# Altium schematic sheet Sense.SchDoc
size OrCAD A
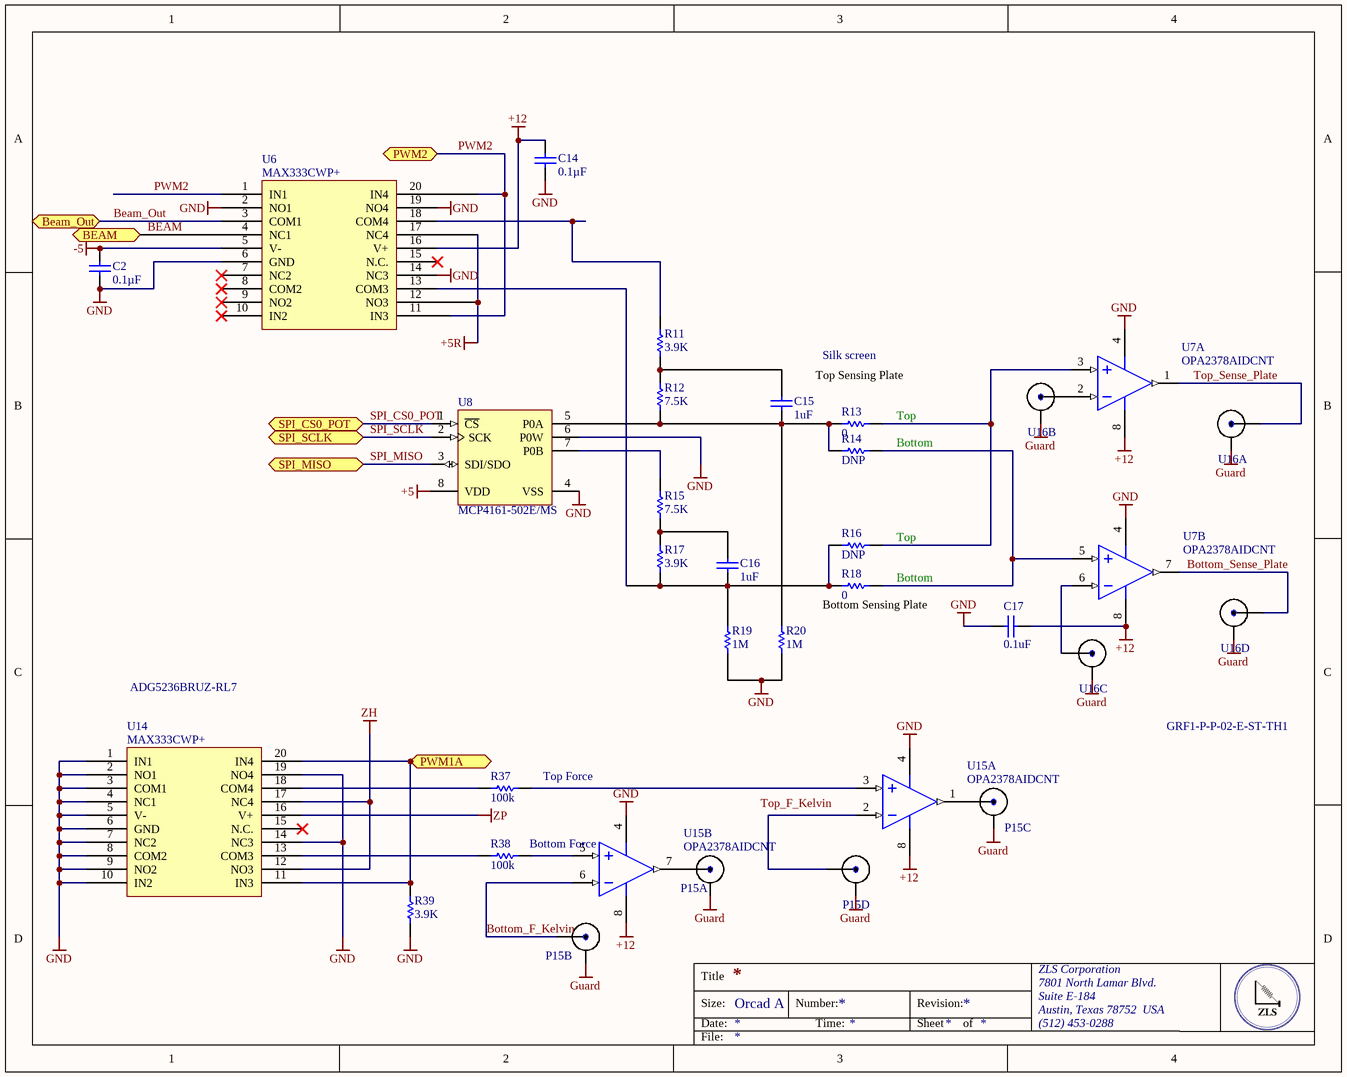
[diagram p0: Sense.SchDoc]

## Parts
C2  Capacitance: 0.1µF  [CAPC0805(2012)145_N]  (hidden comment: CAP CER 0.1UF 25V X7R 0805)
C14  Capacitance: 0.1µF  [CAPC0805(2012)145_N]  (hidden comment: CAP CER 0.1UF 25V X7R 0805)
C15  1uF  [CAPC0603(1608)100_L]
C16  1uF  [CAPC0603(1608)100_L]
C17  0.1uF  [CAPC0402(1005)60_L]
P15  GRF1-P-P-04-E-ST-TH1  [GRF1-P-P-04-E-ST-TH1]  (value not drawn)  (parts A,B,C,D of 4)
R11  3.9K  [RESC0402(1005)_M]
R12  7.5K  [RESC0402(1005)_M]
R13  0  [RESC0402(1005)_M]
R14  DNP  [RESC0402(1005)_M]
R15  7.5K  [RESC0402(1005)_M]
R16  DNP  [RESC0402(1005)_M]
R17  3.9K  [RESC0402(1005)_M]
R18  0  [RESC0402(1005)_M]
R19  1M  [RESC0402(1005)_M]
R20  1M  [RESC0402(1005)_M]
R37  100k  [RESC0402(1005)_M]
R38  100k  [RESC0402(1005)_M]
R39  3.9K  [RESC0402(1005)_M]
U6  MAX333CWP+  [TSOP65P640X90-20N]
U7  OPA2378AIDCNT  [DCN0008A_M]  (parts A,B of 2)
U8  MCP4161-502E/MS  [MSOP-MS8_N]
U14  MAX333CWP+  [TSOP65P640X90-20N]
U15  OPA2378AIDCNT  [DCN0008A_M]  (parts A,B of 2)
U16  GRF1-P-P-04-E-ST-TH1  [GRF1-P-P-04-E-ST-TH1]  (value not drawn)  (parts A,B,C,D of 4)

## Ports
BEAM, Beam_Out, PWM1A, PWM2, SPI_CS0_POT, SPI_MISO, SPI_SCLK

## Nets
+5: U8.8(VDD)
+5R: U6.12(NO3) U6.17(NC4)
+12: C14.2 C17.2 U6.16(V+) U7.8(V+) U15.8(V+)
-5: C2.1 U6.5(V-)
GND: C2.2 C14.1 C17.1 R19.1 R20.1 R39.1 U6.2(NO1) U6.6(GND) U6.14(NC3) U6.19(NO4) U7.4(V-) U8.4(VSS) U8.6(P0W) U14.1(IN1) U14.2(NO1) U14.3(COM1) U14.4(NC1) U14.5(V-) U14.6(GND) U14.7(NC2) U14.8(COM2) U14.9(NO2) U14.10(IN2) U14.14(NC3) U14.19(NO4) U15.4(V-)
Guard: P15.5 P15.6 P15.7 P15.8 U16.5 U16.6 U16.7 U16.8
ZH: U14.12(NO3) U14.17(NC4)
ZP: U14.16(V+)
BEAM: U6.4(NC1) ; port BEAM
Beam_Out: U6.3(COM1) ; port Beam_Out
Bottom_F_Kelvin: P15.2 U15.6(IN_B-)
Bottom_Sense_Plate: U7.7(OUT_B) U16.4
PWM1A: R39.2 U14.11(IN3) U14.20(IN4) ; port PWM1A
PWM2: U6.1(IN1) U6.11(IN3) U6.20(IN4) ; port PWM2
SPI_CS0_POT: U8.1(~{CS}) ; port SPI_CS0_POT
SPI_MISO: U8.3(SDI/SDO) ; port SPI_MISO
SPI_SCLK: U8.2(SCK) ; port SPI_SCLK
Top_Sense_Plate: U7.1(OUT_A) U16.1
NetC15_1: C15.1 R12.1 R13.2 R14.2 R20.2 U8.5(P0A)
NetC15_2: C15.2 R11.1 R12.2
NetC16_1: C16.1 R16.2 R17.1 R18.2 R19.2 U6.13(COM3)
NetC16_2: C16.2 R15.1 R17.2
NetP15_1: P15.1 U15.7(OUT_B)
NetP15_3: P15.3 U15.1(OUT_A)
NetP15_4: P15.4 U15.2(IN_A-)
NetR11_2: R11.2 U6.18(COM4)
NetR13_1: R13.1 R16.1 U7.3(IN_A+)
NetR14_1: R14.1 R18.1 U7.5(IN_B+)
NetR15_2: R15.2 U8.7(P0B)
NetR37_1: R37.1 U15.3(IN_A+)
NetR37_2: R37.2 U14.18(COM4)
NetR38_1: R38.1 U15.5(IN_B+)
NetR38_2: R38.2 U14.13(COM3)
NetU7_2: U7.2(IN_A-) U16.2
NetU7_6: U7.6(IN_B-) U16.3

Not connected (* = marked no-connect by the designer): U6 7(NC2)* 8(COM2)* 9(NO2)* 10(IN2)* 15(N.C.)*; U14 15(N.C.)*

## Notes on the sheet
- Top Sensing Plate
- Silk screen
- Top
- Bottom
- (near R16) Top
- (near R18) Bottom Sensing Plate
- ADG5236BRUZ-RL7
- GRF1-P-P-02-E-ST-TH1
- (near R37) Top Force
- (near U15) Bottom Force
- Labels drawn without touching a wire or pin: Top_F_Kelvin
- Title
- Size:
- Date:
- Orcad A
- Number:
- Time:
- Revision:
- Sheet
- of
- ZLS Corporation
- 7801 North Lamar Blvd.
- Suite E-184
- Austin, Texas 78752  USA
- (512) 453-0288
- File:

## Library data of the parts
C2 C14 = CMP-1036-04795-1: Manufacturer: Murata Electronics North America; Manufacturer Part Number: GRM21BR71E104KA01L; Tolerance: ±10%; Supplier 1: Digi-Key; Supplier Part Number 1: 490-1673-6-ND; RoHS: RoHS Compliant; Category: Capacitors; Stock 1: 891652; Pricing 1: 1=0.2, 10=0.145, 100=0.0683, 500=0.04788, 1000=0.03964 (USD); Packaging: Digi-Reel®; Part Status: Active; Voltage - Rated: 25V; Temperature Coefficient: X7R; Operating Temperature: -55°C ~ 125°C; Features: -; Ratings: -; Applications: General Purpose; Mounting Type: Surface Mount, MLCC; Package / Case: 0805 (2012 Metric); Size / Dimension: 0.079" L x 0.049" W (2.00mm x 1.25mm); Height - Seated (Max): -; Thickness (Max): 0.053" (1.35mm); Lead Spacing: -; Lead Style: -; ComponentLink1URL: http://www.murata.com/~/media/webrenewal/support/library/catalog/products/capacitor/mlcc/c02e.ashx; ComponentLink1Description: http://www.murata.com/~/media/webrenewal/support/library/catalog/products/capacitor/mlcc/c02e.ashx
C15 C16 = CMP-1035-00303-1: CAP 4.3pF 25V ±0.5pF 0603 (1608 Metric) Thickness 1mm SMD; Manufacturer: Samsung Electro-Mechanics; Manufacturer Part Number: CL10B105KA8NNNC; Tolerance: ±10%; Temperature Coefficient: X7R; Notification: Current market demand for these product types have resulted in fluctuating and extending lead times. Lead times may differ.; Supplier 1: Digi-Key; Supplier Part Number 1: 1276-1184-1-ND; RoHS: RoHS Compliant; Category: Capacitors; Stock 1: 1067488; Pricing 1: 1=0.1, 10=0.061, 100=0.027, 500=0.01926, 1000=0.01513 (USD); Packaging: Cut Tape (CT); Part Status: Active; Voltage - Rated: 25V; Operating Temperature: -55°C ~ 125°C; Features: -; Ratings: -; Applications: General Purpose; Mounting Type: Surface Mount, MLCC; Package / Case: 0603 (1608 Metric); Size / Dimension: 0.063" L x 0.032" W (1.60mm x 0.80mm); Height - Seated (Max): -; Thickness (Max): 0.035" (0.90mm); Lead Spacing: -; Lead Style: -; ComponentLink1URL: http://media.digikey.com/pdf/Data%20Sheets/Samsung%20PDFs/CL_Series_MLCC_ds.pdf; ComponentLink1Description: http://media.digikey.com/pdf/Data%20Sheets/Samsung%20PDFs/CL_Series_MLCC_ds.pdf
C17 = CMP-1034-00252-1: CAP CER 0.1UF 10V X7R 0402; Manufacturer: Murata Electronics North America; Manufacturer Part Number: GRM155R71A104KA01D; Tolerance: ±10%; Supplier 1: Digi-Key; Supplier Part Number 1: 490-6321-1-ND; RoHS: RoHS Compliant; Category: Capacitors; Stock 1: 2920395; Pricing 1: 1=0.1, 10=0.014, 100=0.0063, 500=0.00446, 1000=0.00351, 2500=0.00319, 5000=0.00293 (USD); Packaging: Cut Tape (CT); Part Status: Active; Voltage - Rated: 10V; Temperature Coefficient: X7R; Operating Temperature: -55°C ~ 125°C; Features: -; Ratings: -; Applications: General Purpose; Mounting Type: Surface Mount, MLCC; Package / Case: 0402 (1005 Metric); Size / Dimension: 0.039" L x 0.020" W (1.00mm x 0.50mm); Height - Seated (Max): -; Thickness (Max): 0.022" (0.55mm); Lead Spacing: -; ComponentLink1URL: http://www.murata.com/~/media/webrenewal/support/library/catalog/products/capacitor/mlcc/c02e.ashx?la=en-us; ComponentLink1Description: http://www.murata.com/~/media/webrenewal/support/library/catalog/products/capacitor/mlcc/c02e.ashx?la=en-us
R11 R12 R15 R17 R19 R20 R39 = CMP-1011-00463-1
R13 R14 R16 R18 R37 R38 = CMP-1011-00651-1
U6 U14 = MAX333CWP+: IC SWITCH QUAD SPDT 20TSSOP; Manufacturer: Maxim; Manufacturer Part Number: MAX333AEUP+; Max Supply Voltage: 30V; Min Supply Voltage: 10V; Min Dual Supply Voltage: 4.5V; Max Dual Supply Voltage: 20V; On-State Resistance: 35R; Operating Supply Current: 1uA; Supply Type: Single,Dual; Max Power Dissipation: 559mW; Turn-On Delay Time: 175ns; Turn-Off Delay Time: 145ns; Max Supply Current: 250uA; Number of Bits: 4; Dual Supply Voltage: 15V; Supplier 1: Mouser; Supplier Part Number 1: 700-MAX333AEUP; Stock 1: 664; Pricing 1: 1=6.77, 10=6.43, 50=5.8, 100=5.8, 1000=5.62, 10000=5.62 (USD); Case/Package: TSSOP; Number of Pins: 20; Weight: 0.006737oz; Min Operating Temperature: -40°C; Max Operating Temperature: 85°C; Packaging: Rail/Tube; Package Quantity: 74; Throw Configuration: SPDT; Number of Channels: 4; Length: 6.6mm; Height: 0.95mm; Width: 4.5mm; Radiation Hardening: No; Lead Free: Lead Free; REACH SVHC: Unknown; ComponentLink1URL: https://datasheet.ciiva.com/2978/max333a-2978850.pdf; ComponentLink1Description: https://datasheet.ciiva.com/2978/max333a-2978850.pdf; ComponentLink2URL: https://datasheet.ciiva.com/30478/0900766b81253c85-30478260.pdf; ComponentLink2Description: https://datasheet.ciiva.com/30478/0900766b81253c85-30478260.pdf; ComponentLink3URL: https://datasheet.ciiva.com/1674/max333a-1674617.pdf; ComponentLink3Description: https://datasheet.ciiva.com/1674/max333a-1674617.pdf; ComponentLink4URL: https://datasheet.ciiva.com/26825/max333aeup-26825546.pdf; ComponentLink4Description: https://datasheet.ciiva.com/26825/max333aeup-26825546.pdf
U7 U15 = CMP-0272-01124-3: Low-Noise, 900 kHz, RRIO, Precision Operational Amplifier, Zero-Drift Series, 2.2 to 5.5 V, -40 to 125 degC, 8-pin SOP (DCN8), Green (RoHS & no Sb/Br); Manufacturer: Texas Instruments; Number of Channels: 2; Offset Drift(Typ)(uV/C): 0.25; Total Supply Voltage(Min)(+5V is 5, +/-5V is 10): 2.2; Vn at 1kHz(Typ)(nV/rtHz): 20; Iq per channel(Max)(mA): 0.15; Total Supply Voltage(Max)(+5V is 5, +/-5V is 10): 5.5; Sub Family: Low Offset Voltage Amplifier (<=500uV), Low Power Amp (<=500uA), Low Supply Voltage Amplifier (<=2.7V), Precision Amplifier, Zero Drift Precision Amplifier; IIB(Max)(pA): 550; Vio (25C)(Max)(mV): 0.07; CMRR(Min)(dB): 100; Slew Rate(Typ)(V/us): 0.4; PartNumber: OPA2378AIDCNT; DatasheetVersion: SBOS417D; ComponentLink2Description: Datasheet; ComponentLink3URL: http://www.ti.com/lit/ml/mpds099c/mpds099c.pdf; ComponentLink2URL: http://www.ti.com/general/docs/lit/getliterature.tsp?genericPartNumber=OPA2378&fileType=pdf; PackageReference: DCN0008A; PackageDescription: 8-Pin Plastic Small Outline, Body 1.6 x 2.9 mm, Pitch 0.65 mm; Code_JEDEC: MO-178; PackageVersion: 4202106/D, 11/2009; ComponentLink3Description: Package Specification; Eco-Plan: Green (RoHS & no Sb/Br); ComponentLink1Description: Manufacturer URL; Mounting Technology: Surface Mount; ComponentLink1URL: http://www.ti.com/; PartId: 1
U8 = CMP-0188-00907-2: 7/8-Bit Single/Dual SPI Digital POT with Non-Volatile Memory, 8-Pin MSOP, Extended Temperature; ComponentLink2Description: Datasheet; PackageDescription: 8-Lead Plastic Micro Small Outline Package (MS) [MSOP]; PackageVersion: revBB, Aug-2009; PackageReference: MSOP-MS8; ComponentLink1Description: Manufacturer URL; ComponentLink3URL: http://www.microchip.com/stellent/groups/techpub_sg/documents/packagingspec/en012702.pdf; DatasheetVersion: revB, Dec-2008; ComponentLink3Description: Package Specification; ComponentLink1URL: http://www.microchip.com/; RevisionNote: URLs added.; ComponentLink2URL: http://ww1.microchip.com/downloads/en/DeviceDoc/22059b.pdf